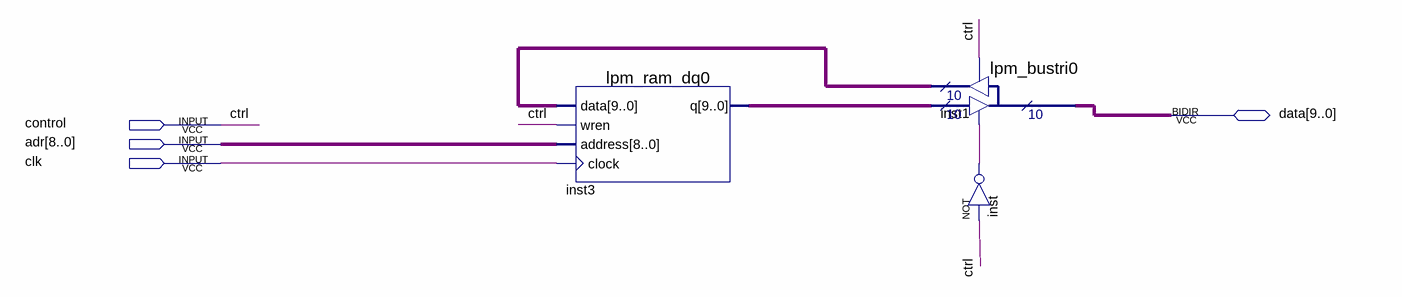
[diagram p0: schematic sheet]
// Quartus schematic Block1.bdf as structural Verilog: 3 symbols, 4 pins
module Block1 (
  input  control,
  input  [8:0] adr,
  input  clk,
  inout  [9:0] data
);

  wire inst_out;
  wire [9:0] inst1_result, inst3_q;

  lpm_ram_dq0 inst3 (.data(inst1_result), .wren(control), .address(adr), .clock(clk), .q(inst3_q));
  lpm_bustri0 inst1 (.enabledt(inst_out), .data(inst3_q), .enabletr(control), .result(inst1_result), .tridata(data));
  not inst (inst_out, control);

  // Other names for the same wires on the sheet: ctrl = control
endmodule
